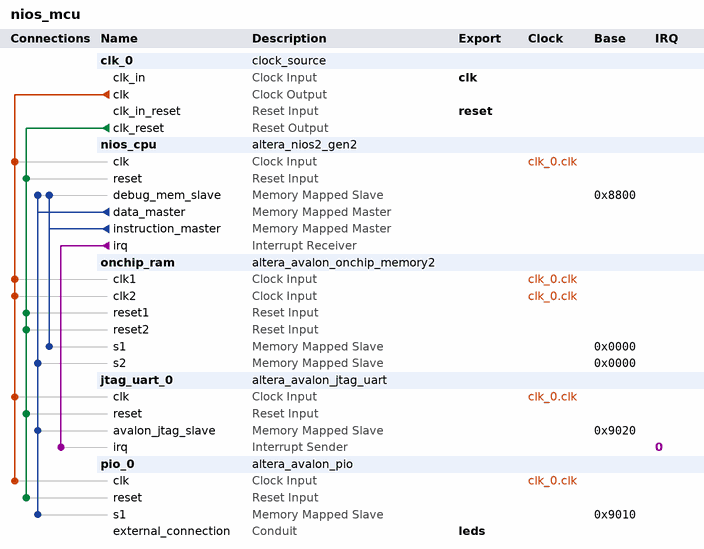
[diagram p0: system contents]
# Platform Designer (Qsys) system nios_mcu, Cyclone IV E EP4CE22F17C6
# Parameters at their usual value, and those the tool derives, are not listed.
package require -exact qsys 18.1
create_system nios_mcu
set_project_property DEVICE_FAMILY {Cyclone IV E}
set_project_property DEVICE EP4CE22F17C6

add_instance clk_0 clock_source 18.1
set_instance_parameter_value clk_0 clockFrequency 50000000

add_instance nios_cpu altera_nios2_gen2 18.1
set_instance_parameter_value nios_cpu dcache_size 2048
set_instance_parameter_value nios_cpu exceptionSlave onchip_ram.s1
set_instance_parameter_value nios_cpu icache_size 4096
set_instance_parameter_value nios_cpu impl Tiny
set_instance_parameter_value nios_cpu resetSlave onchip_ram.s1

add_instance onchip_ram altera_avalon_onchip_memory2 18.1
set_instance_parameter_value onchip_ram dataWidth 32
set_instance_parameter_value onchip_ram dualPort true
set_instance_parameter_value onchip_ram initMemContent true
set_instance_parameter_value onchip_ram initializationFileName onchip_mem.hex
set_instance_parameter_value onchip_ram memorySize 32768

add_instance jtag_uart_0 altera_avalon_jtag_uart 18.1
set_instance_parameter_value jtag_uart_0 simInteractiveOptions NO_INTERACTIVE_WINDOWS

add_instance pio_0 altera_avalon_pio 18.1
set_instance_parameter_value pio_0 direction Output
set_instance_parameter_value pio_0 width 8

# connections
add_connection clk_0.clk jtag_uart_0.clk clock
add_connection clk_0.clk nios_cpu.clk clock
add_connection clk_0.clk onchip_ram.clk1 clock
add_connection clk_0.clk onchip_ram.clk2 clock
add_connection clk_0.clk pio_0.clk clock
add_connection clk_0.clk_reset jtag_uart_0.reset reset
add_connection clk_0.clk_reset nios_cpu.reset reset
add_connection clk_0.clk_reset onchip_ram.reset1 reset
add_connection clk_0.clk_reset onchip_ram.reset2 reset
add_connection clk_0.clk_reset pio_0.reset reset
add_connection nios_cpu.data_master jtag_uart_0.avalon_jtag_slave avalon
set_connection_parameter_value nios_cpu.data_master/jtag_uart_0.avalon_jtag_slave baseAddress 0x9020
add_connection nios_cpu.data_master nios_cpu.debug_mem_slave avalon
set_connection_parameter_value nios_cpu.data_master/nios_cpu.debug_mem_slave baseAddress 0x8800
add_connection nios_cpu.data_master onchip_ram.s2 avalon
set_connection_parameter_value nios_cpu.data_master/onchip_ram.s2 baseAddress 0x0000
add_connection nios_cpu.data_master pio_0.s1 avalon
set_connection_parameter_value nios_cpu.data_master/pio_0.s1 baseAddress 0x9010
add_connection nios_cpu.instruction_master nios_cpu.debug_mem_slave avalon
set_connection_parameter_value nios_cpu.instruction_master/nios_cpu.debug_mem_slave baseAddress 0x8800
add_connection nios_cpu.instruction_master onchip_ram.s1 avalon
set_connection_parameter_value nios_cpu.instruction_master/onchip_ram.s1 baseAddress 0x0000
add_connection nios_cpu.irq jtag_uart_0.irq interrupt
set_connection_parameter_value nios_cpu.irq/jtag_uart_0.irq irqNumber 0

# exported interfaces
add_interface clk clock sink
set_interface_property clk EXPORT_OF clk_0.clk_in
add_interface leds conduit end
set_interface_property leds EXPORT_OF pio_0.external_connection
add_interface reset reset sink
set_interface_property reset EXPORT_OF clk_0.clk_in_reset

set_interconnect_requirement {$system} qsys_mm.clockCrossingAdapter HANDSHAKE
set_interconnect_requirement {$system} qsys_mm.enableEccProtection FALSE
set_interconnect_requirement {$system} qsys_mm.insertDefaultSlave FALSE
set_interconnect_requirement {$system} qsys_mm.maxAdditionalLatency 1

save_system nios_mcu.qsys
